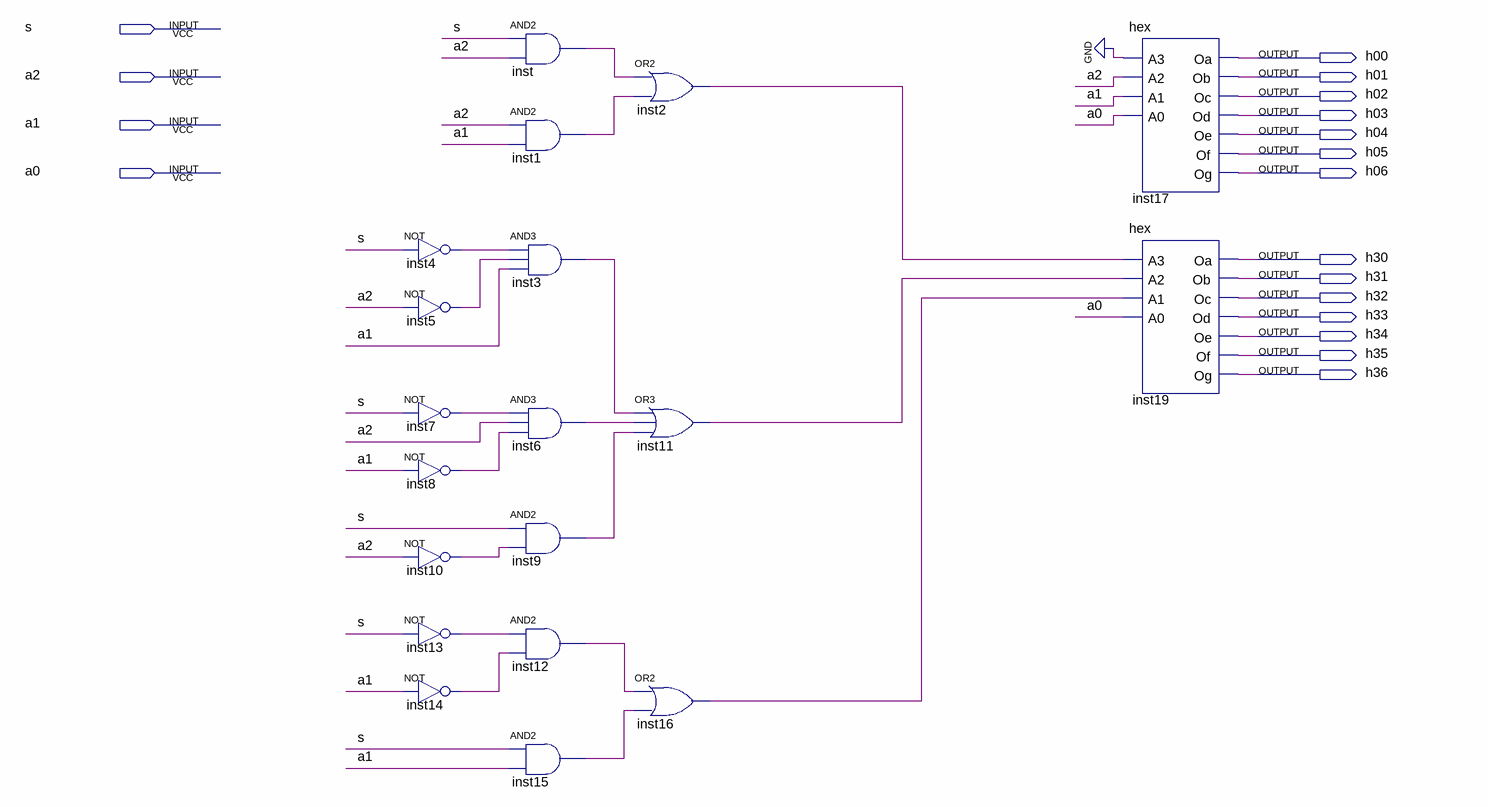
[diagram p0: schematic sheet]
// Quartus schematic hw01.bdf as structural Verilog: 19 symbols, 18 pins
module hw01 (
  input  s,
  input  a2,
  input  a1,
  input  a0,
  output h00,
  output h01,
  output h02,
  output h03,
  output h04,
  output h05,
  output h06,
  output h30,
  output h31,
  output h32,
  output h33,
  output h34,
  output h35,
  output h36
);

  wire inst1_out, inst2_out, inst3_out, inst4_out, inst5_out, inst6_out, inst7_out, inst8_out, inst9_out,
       inst10_out, inst11_out, inst12_out, inst13_out, inst14_out, inst15_out, inst16_out, inst_out;

  not inst4 (inst4_out, s);
  not inst5 (inst5_out, a2);
  not inst7 (inst7_out, s);
  not inst8 (inst8_out, a1);
  not inst10 (inst10_out, a2);
  not inst13 (inst13_out, s);
  not inst14 (inst14_out, a1);
  and inst (inst_out, s, a2);
  and inst1 (inst1_out, a2, a1);
  and inst3 (inst3_out, inst4_out, inst5_out, a1);
  and inst6 (inst6_out, inst7_out, a2, inst8_out);
  and inst9 (inst9_out, s, inst10_out);
  and inst12 (inst12_out, inst13_out, inst14_out);
  and inst15 (inst15_out, s, a1);
  or inst2 (inst2_out, inst_out, inst1_out);
  or inst11 (inst11_out, inst3_out, inst6_out, inst9_out);
  or inst16 (inst16_out, inst12_out, inst15_out);
  hex inst17 (
    .A3(1'b0), .A2(a2), .A1(a1), .A0(a0), .Oa(h00), .Ob(h01), .Oc(h02), .Od(h03), .Oe(h04), .Of(h05), .Og(h06));
  hex inst19 (
    .A3(inst2_out), .A2(inst11_out), .A1(inst16_out), .A0(a0), .Oa(h30), .Ob(h31), .Oc(h32), .Od(h33),
    .Oe(h34), .Of(h35), .Og(h36));
endmodule
